# Altium schematic sheet HeadController.SchDoc
size A4
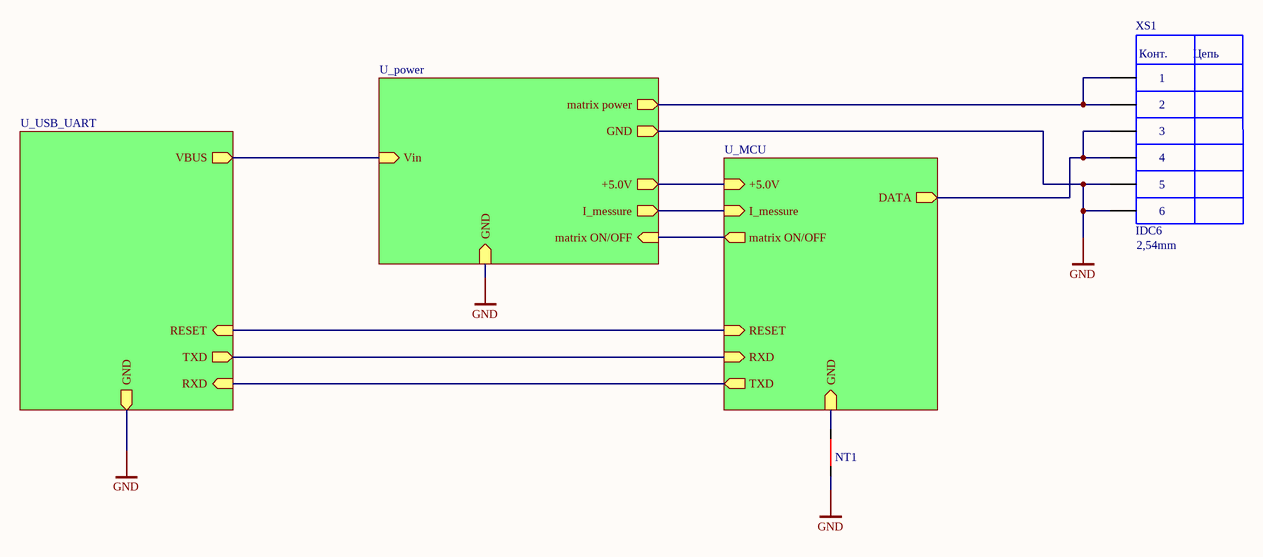
[diagram p0: HeadController.SchDoc]

## Parts
NT1  (no value)  [NT]  (net tie, no BOM)
XS1  IDC6  Package: 2,54mm  [IDC-6 (2.54) (end face)]

## Sub-sheets
U_MCU = MCU.SchDoc: GND (in), +5.0V (in), RXD (in), TXD (out), I_messure (in), matrix ON/OFF (out), DATA (out), RESET (in)
U_power = power.SchDoc: +5.0V (out), Vin (in), I_messure (out), matrix ON/OFF (in), matrix power (out), GND (out), GND (in)
U_USB_UART = USB_UART.SchDoc: TXD (out), RXD (in), VBUS (out), GND (out), RESET (in)

## Nets
GND: NT1.2 XS1.5 XS1.6 ; sheet U_power/GND, sheet U_power/GND, sheet U_USB_UART/GND
NetNT1_1: NT1.1 ; sheet U_MCU/GND
NetXS1_1: XS1.1 XS1.2 ; sheet U_power/matrix power
NetXS1_3: XS1.3 XS1.4 ; sheet U_MCU/DATA
(unnamed): sheet U_MCU/+5.0V, sheet U_power/+5.0V
(unnamed): sheet U_MCU/RXD, sheet U_USB_UART/TXD
(unnamed): sheet U_MCU/TXD, sheet U_USB_UART/RXD
(unnamed): sheet U_MCU/I_messure, sheet U_power/I_messure
(unnamed): sheet U_MCU/matrix ON/OFF, sheet U_power/matrix ON/OFF
(unnamed): sheet U_MCU/RESET, sheet U_USB_UART/RESET
(unnamed): sheet U_power/Vin, sheet U_USB_UART/VBUS

## Notes on the sheet
- (in symbol IDC6) Конт.; Цепь

## Library data of the parts
NT1 = NT
XS1 = IDC6: ValueBOM: Разъём IDC6 прямой; Type: XS; Value: IDC6